# Altium project ICSL PS REV 0_2.PrjPcb
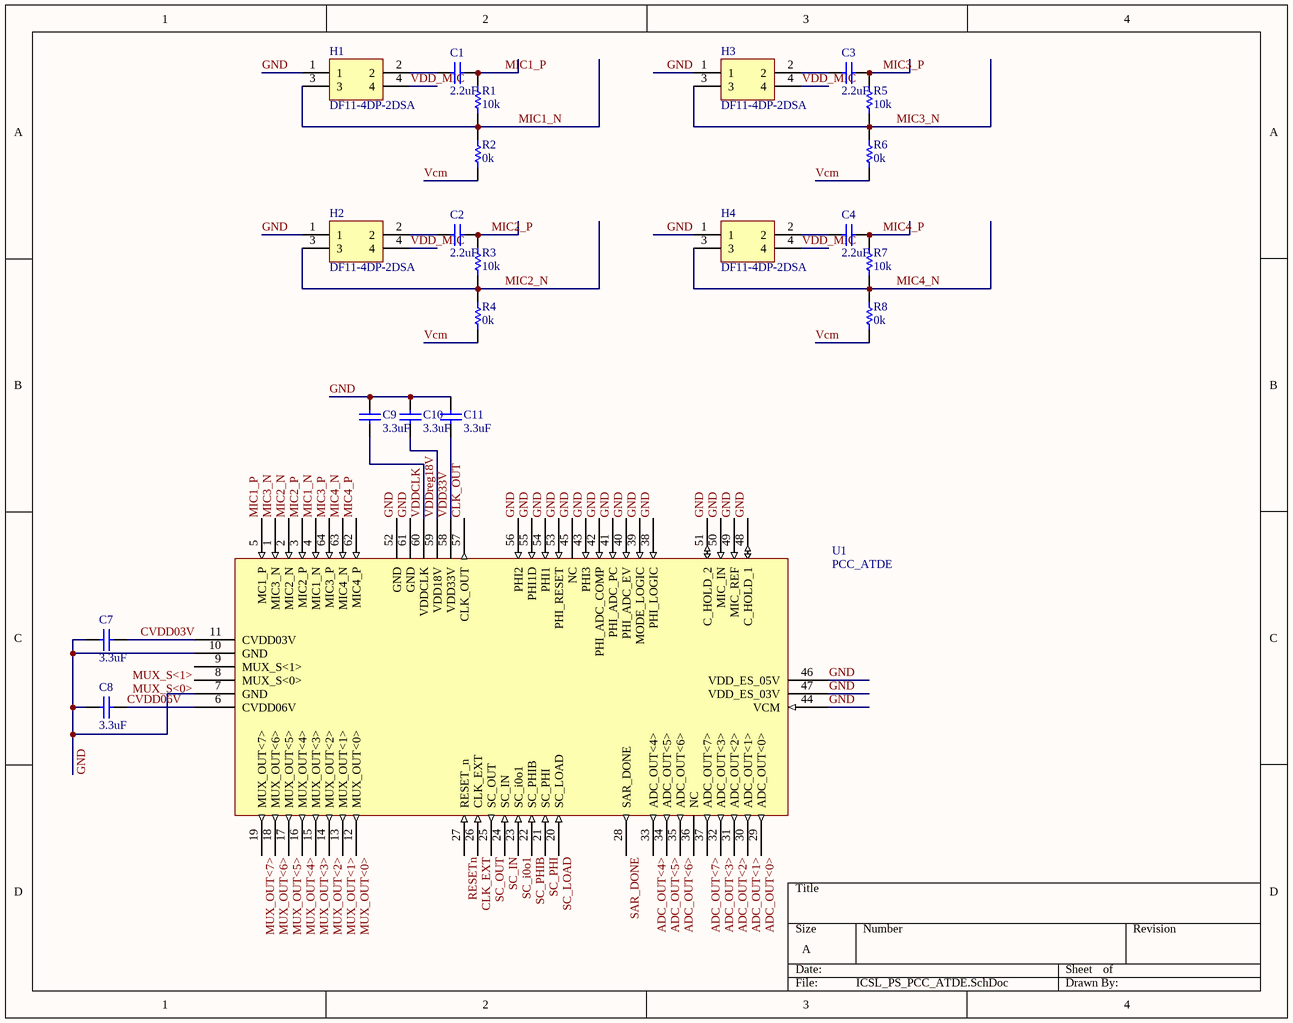
[diagram p0: ICSL_PS_PCC_ATDE.SchDoc]
5 sheets, 84 parts. Net scope: global (net labels, ports and power ports of the same name join across sheets).
Sheets:
  ICSL_PS_PCC_ATDE.SchDoc
  ICSL_PS_POWER.SchDoc
  ICSL_PS_BMD.SchDoc
  ICSL_PS_CON.SchDoc
  ICSL_PS_MEMS_MIC_V1.SchDoc

## Sheet ICSL_PS_PCC_ATDE.SchDoc
size A

### Parts
C1  2.2uF  [CAPC1608X90X35NL15T15]
C2  2.2uF  [CAPC1608X90X35NL15T15]
C3  2.2uF  [CAPC1608X90X35NL15T15]
C4  2.2uF  [CAPC1608X90X35NL15T15]
C7  3.3uF  [CAPC1608X90X35NL15T15]
C8  3.3uF  [CAPC1608X90X35NL15T15]
C9  3.3uF  [CAPC1608X90X35NL15T15]
C10  3.3uF  [CAPC1608X90X35NL15T15]
C11  3.3uF  [CAPC1608X90X35NL15T15]
H1  DF11-4DP-2DSA  [PCB-xg1cw1zwm1fua28k7qwq-1]
H2  DF11-4DP-2DSA  [PCB-xg1cw1zwm1fua28k7qwq-1]
H3  DF11-4DP-2DSA  [PCB-xg1cw1zwm1fua28k7qwq-1]
H4  DF11-4DP-2DSA  [PCB-xg1cw1zwm1fua28k7qwq-1]
R1  10k  [RESC1609X50X30NL10T20]
R2  0k  [RESC1609X50X30NL10T20]
R3  10k  [RESC1609X50X30NL10T20]
R4  0k  [RESC1609X50X30NL10T20]
R5  10k  [RESC1609X50X30NL10T20]
R6  0k  [RESC1609X50X30NL10T20]
R7  10k  [RESC1609X50X30NL10T20]
R8  0k  [RESC1609X50X30NL10T20]
U1  PCC_ATDE  [Quad64]

### Nets
ADC_OUT<0>: U1.29(ADC_OUT<0>)
ADC_OUT<1>: U1.30(ADC_OUT<1>)
ADC_OUT<2>: U1.31(ADC_OUT<2>)
ADC_OUT<3>: U1.32(ADC_OUT<3>)
ADC_OUT<4>: U1.33(ADC_OUT<4>)
ADC_OUT<5>: U1.34(ADC_OUT<5>)
ADC_OUT<6>: U1.35(ADC_OUT<6>)
ADC_OUT<7>: U1.37(ADC_OUT<7>)
CLK_EXT: U1.26(CLK_EXT)
CLK_OUT: U1.57(CLK_OUT)
CVDD03V: C7.1 U1.11(CVDD03V)
CVDD06V: C8.1 U1.6(CVDD06V)
GND: C7.2 C8.2 C9.2 C10.1 C11.1 H1.1 H2.1 H3.1 H4.1 U1.7(GND) U1.10(GND) U1.38(PHI_LOGIC) U1.39(MODE_LOGIC) U1.40(PHI_ADC_EV) U1.41(PHI_ADC_PC) U1.42(PHI_ADC_COMP) U1.43(PHI3) U1.44(VCM) U1.45(NC) U1.46(VDD_ES_05V) U1.47(VDD_ES_03V) U1.48(C_HOLD_1) U1.49(MIC_REF) U1.50(MIC_IN) U1.51(C_HOLD_2) U1.52(GND) U1.53(PHI_RESET) U1.54(PHI1) U1.55(PHI1D) U1.56(PHI2) U1.61(GND)
MIC1_N: H1.3 R1.2 R2.2 U1.4(MIC1_N)
MIC1_P: C1.2 R1.1 U1.5(MC1_P)
MIC2_N: H2.3 R3.2 R4.2 U1.2(MIC2_N)
MIC2_P: C2.2 R3.1 U1.3(MIC2_P)
MIC3_N: H3.3 R5.2 R6.2 U1.1(MIC3_N)
MIC3_P: C3.2 R5.1 U1.64(MIC3_P)
MIC4_N: H4.3 R7.2 R8.2 U1.63(MIC4_N)
MIC4_P: C4.2 R7.1 U1.62(MIC4_P)
MUX_OUT<0>: U1.12(MUX_OUT<0>)
MUX_OUT<1>: U1.13(MUX_OUT<1>)
MUX_OUT<2>: U1.14(MUX_OUT<2>)
MUX_OUT<3>: U1.15(MUX_OUT<3>)
MUX_OUT<4>: U1.16(MUX_OUT<4>)
MUX_OUT<5>: U1.17(MUX_OUT<5>)
MUX_OUT<6>: U1.18(MUX_OUT<6>)
MUX_OUT<7>: U1.19(MUX_OUT<7>)
MUX_S<0>: U1.8(MUX_S<0>)
MUX_S<1>: U1.9(MUX_S<1>)
RESETn: U1.27(RESET_n)
SAR_DONE: U1.28(SAR_DONE)
SC_i0o1: U1.23(SC_i0o1)
SC_IN: U1.24(SC_IN)
SC_LOAD: U1.20(SC_LOAD)
SC_OUT: U1.25(SC_OUT)
SC_PHI: U1.21(SC_PHI)
SC_PHIB: U1.22(SC_PHIB)
Vcm: R2.1 R4.1 R6.1 R8.1
VDD33V: C11.2 U1.58(VDD33V)
VDD_MIC: H1.4 H2.4 H3.4 H4.4
VDDCLK: C9.1 U1.60(VDDCLK)
VDDreg18V: C10.2 U1.59(VDD18V)
NetC1_1: C1.1 H1.2
NetC2_1: C2.1 H2.2
NetC3_1: C3.1 H3.2
NetC4_1: C4.1 H4.2

Not connected (* = marked no-connect by the designer): U1 36(NC)

### Library data of the parts
C1-C4 C7-C11 = CMP-4105021-1: Multilayer Ceramic Capacitors MLCC - SMD/SMT 0603 10uF 4VOLTS X5R 10%; Manufacturer Part Number: 06034D106KAT2A; Temperature Coefficient / Code: +/- 15 %; Case Width: 0.81 mm; Voltage Rating DC: 4 V; Brand: AVX; Case Length: 1.6 mm; Type: Commercial Surface Mount Chip; Case Height: 0.9 mm; Dimensions: 0.81 mm W x 1.6 mm L x 0.9 mm H; Capacitance: 10 uF; Termination Style: SMD/SMT; Dielectric: X5R; RoHS: Details; Factory Pack Quantity: 3000; Ciiva URL: https://ciiva.com/part/06034d106kat2a-4105021; Operating Temperature Range: - 55 C to + 85 C; Case Code - mm: 1608; Case Code - in: 0603; Tolerance: 10 %; Voltage Rating: 4 V; Manufacturer: AVX; Minimum Operating Temperature: - 55 C; Product Category: Multilayer Ceramic Capacitors MLCC - SMD/SMT; Maximum Operating Temperature: + 85 C; Package / Case: 0603 (1608 metric); Product: General Type MLCCs; Packaging: Reel; CiivaID: 4105021
H1-H4 = DF11-4DP-2DSA(01): 4 Position 2mm Pitch Dual Row (2x2) Straight Through Hole Pin Header; Housing Color: Black; Contact Material: Brass
R1 R3 = CMP-1856112-2: RES SMD OHM 5% 1/10W 0603; Lead-Free Status: Lead Free; Power Rating: 0.1 W; Resistance: 200K; Temperature Coefficient: 200.0 ppm/°C; Voltage Rating (DC): 75.0 V; Case/Package: 0603; Mounting Style: Surface Mount; Number of Pins: 2; Octopart Url: https://octopart.com/crcw06032m20jnea-vishay-46591516; OctopartID: 4b2a80e6805094ed; Packaging: Cut Tape (CT); Resistance Tolerance: ±5%; RoHS: Compliant; Size-Height: 0.00045 m; Size-Length: 0.00155 m; Size-Width: 0.00085 m
R2 R4 R8 = CMP-1856112-2: RES SMD 2.2M OHM 5% 1/10W 0603; Lead-Free Status: Lead Free; Power Rating: 0.1 W; Resistance: 0; Temperature Coefficient: 200.0 ppm/°C; Voltage Rating (DC): 75.0 V; Case/Package: 0603; Mounting Style: Surface Mount; Number of Pins: 2; Octopart Url: https://octopart.com/crcw06032m20jnea-vishay-46591516; OctopartID: 4b2a80e6805094ed; Packaging: Cut Tape (CT); Resistance Tolerance: ±5%; RoHS: Compliant; Size-Height: 0.00045 m; Size-Length: 0.00155 m; Size-Width: 0.00085 m
R5 = CMP-1856112-2: RES SMD 2.2M OHM 5% 1/10W 0603; Lead-Free Status: Lead Free; Power Rating: 0.1 W; Resistance: 200K; Temperature Coefficient: 200.0 ppm/°C; Voltage Rating (DC): 75.0 V; Case/Package: 0603; Mounting Style: Surface Mount; Number of Pins: 2; Octopart Url: https://octopart.com/crcw06032m20jnea-vishay-46591516; OctopartID: 4b2a80e6805094ed; Packaging: Cut Tape (CT); Resistance Tolerance: ±5%; RoHS: Compliant; Size-Height: 0.00045 m; Size-Length: 0.00155 m; Size-Width: 0.00085 m
R6 = CMP-1856112-2: RES SMD 2.2M OHM 5% 1/10W 0603; Lead-Free Status: Lead Free; Power Rating: 0.1 W; Resistance: 2200000.0 Ω; Temperature Coefficient: 200.0 ppm/°C; Voltage Rating (DC): 75.0 V; Case/Package: 0603; Mounting Style: Surface Mount; Number of Pins: 2; Octopart Url: https://octopart.com/crcw06032m20jnea-vishay-46591516; OctopartID: 4b2a80e6805094ed; Packaging: Cut Tape (CT); Resistance Tolerance: ±5%; RoHS: Compliant; Size-Height: 0.00045 m; Size-Length: 0.00155 m; Size-Width: 0.00085 m
R7 = CMP-1856112-2: RES SMD  OHM 5% 1/10W 0603; Lead-Free Status: Lead Free; Power Rating: 0.1 W; Resistance: 2200000.0 Ω; Resistance Tolerance: 200K; Temperature Coefficient: 200.0 ppm/°C; Voltage Rating (DC): 75.0 V; Case/Package: 0603; Mounting Style: Surface Mount; Number of Pins: 2; Octopart Url: https://octopart.com/crcw06032m20jnea-vishay-46591516; OctopartID: 4b2a80e6805094ed; Packaging: Cut Tape (CT); RoHS: Compliant; Size-Height: 0.00045 m; Size-Length: 0.00155 m; Size-Width: 0.00085 m
U1 = CMP-47mcin27x3h8n761pmad-3: ASP; CustomComponentID: 47mcin27x3h8n761pmad

## Sheet ICSL_PS_POWER.SchDoc
size 381 x 241 mm
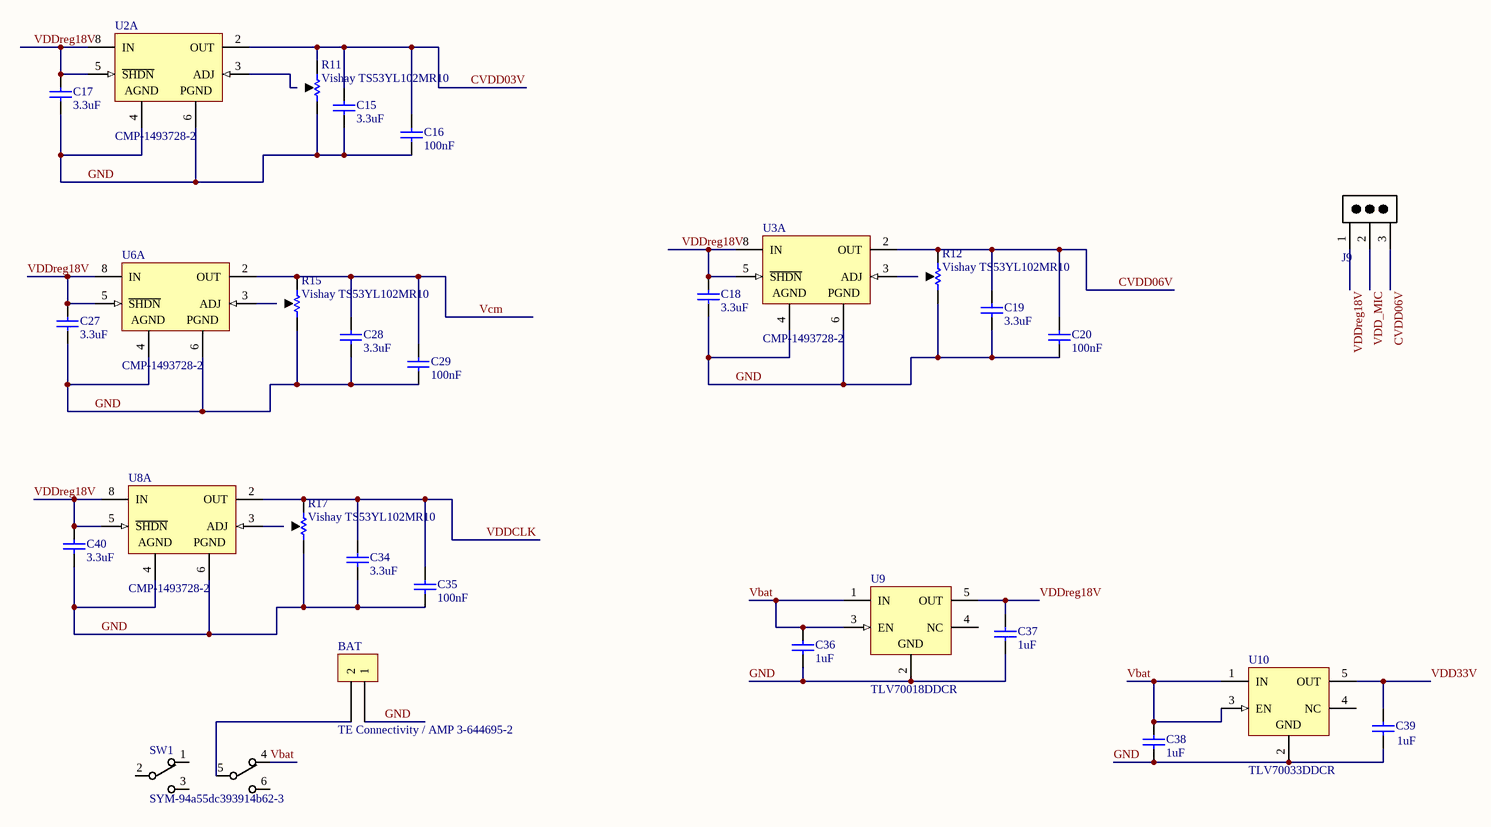
[diagram p1: ICSL_PS_POWER.SchDoc]

### Parts
BAT  TE Connectivity / AMP 3-644695-2  [PCB-i8m17woc8q0u0fbeoczf-1]
C15  3.3uF
C16  100nF  [CAPC1608X90X35NL15T15]
C17  3.3uF
C18  3.3uF
C19  3.3uF  [CAPC2013X94X50LL20T25]
C20  100nF  [CAPC1608X90X35NL15T15]
C27  3.3uF  [CAPC2013X94X50LL20T25]
C28  3.3uF  [CAPC2013X94X50LL20T25]
C29  100nF  [CAPC1608X90X35NL15T15]
C34  3.3uF  [CAPC2013X94X50LL20T25]
C35  100nF  [CAPC1608X90X35NL15T15]
C36  1uF  [CAPC2013X94X50LL20T25]
C37  1uF  [CAPC2013X94X50LL20T25]
C38  1uF  [CAPC2013X94X50LL20T25]
C39  1uF  [CAPC2013X94X50LL20T25]
C40  3.3uF  [CAPC2013X94X50LL20T25]
J9  3M 961103-6404-AR  [JP2]  (value not drawn)
R11  Vishay TS53YL102MR10  [PCB-2411124-1]
R12  Vishay TS53YL102MR10  [PCB-2411124-1]
R15  Vishay TS53YL102MR10  [PCB-2411124-1]
R17  Vishay TS53YL102MR10  [PCB-2411124-1]
SW1  SYM-94a55dc393914b62-3  [PCB-ixy6r264hz8u4okoxsrw-1]
U2  CMP-1493728-2  [LT-S8-8_N]  (part A of 2)
U3  CMP-1493728-2  [LT-S8-8_N]  (part A of 2)
U6  CMP-1493728-2  [LT-S8-8_N]  (part A of 2)
U8  CMP-1493728-2  [LT-S8-8_N]  (part A of 2)
U9  TLV70018DDCR  [TI-DDC5_L]
U10  TLV70033DDCR  [PCB-o8wu4fpdtd8bqe2xojjk-1]

### Nets
CVDD03V: C15.2 C16.1 R11.1 U2.2(OUT)
CVDD06V: C19.2 C20.1 J9.3 R12.1 U3.2(OUT)
GND: BAT.1 C15.1 C16.2 C17.1 C18.1 C19.1 C20.2 C27.1 C28.1 C29.1 C34.1 C35.1 C36.1 C37.1 C38.1 C39.2 C40.1 R11.3 R12.3 R15.3 R17.3 U2.4(AGND) U2.6(PGND) U3.4(AGND) U3.6(PGND) U6.4(AGND) U6.6(PGND) U8.4(AGND) U8.6(PGND) U9.2(GND) U10.2(GND)
Vbat: C36.2 C38.2 SW1.4 U9.1(IN) U9.3(EN) U10.1(IN) U10.3(EN)
Vcm: C28.2 C29.2 R15.1 U6.2(OUT)
VDD33V: C39.1 U10.5(OUT)
VDD_MIC: J9.2
VDDCLK: C34.2 C35.2 R17.1 U8.2(OUT)
VDDreg18V: C17.2 C18.2 C27.2 C37.2 C40.2 J9.1 U2.5(~{SHDN}) U2.8(IN) U3.5(~{SHDN}) U3.8(IN) U6.5(~{SHDN}) U6.8(IN) U8.5(~{SHDN}) U8.8(IN) U9.5(OUT)
NetBAT_2: BAT.2 SW1.5
NetR11_2: R11.2 U2.3(ADJ)
NetR12_2: R12.2 U3.3(ADJ)
NetR15_2: R15.2 U6.3(ADJ)
NetR17_2: R17.2 U8.3(ADJ)

Not connected (* = marked no-connect by the designer): SW1 1 2 3 6; U9 4(NC); U10 4(NC)

### Library data of the parts
BAT = CMP-2792ecc2f21af855-6: Connector Unshrouded Header 2 Position 2.54mm Solder Straight Thru-Hole; Voltage Rating (AC): 250 V; Number of Positions: 2; Mounting Angle: 180 °; Lead-Free Status: Lead Free; Shrouded: No; ELV Compliant: Compliant; Gender: Male; Flammability Rating: UL 94 V-0; Number of Rows: 1; Housing Color: Natural; Size-Width: 2.34 mm; Mounting Style: Through Hole; Orientation: Vertical; Lifecycle Status: Active; Manufacturer Part Number: 3-644695-2; OctopartID: 2792ecc2f21af855; RoHS: Compliant; Pin Pitch: 2.54 mm; Contact Plating: Tin; Housing Material: Polyester; Size-Length: 4.80 mm; Contact Material: Copper Alloy; Size-Height: 2.54 mm; Number of Contacts: 2; Packaging: Box, Bag; Octopart URL: http://octopart.com/3-644695-2-te+connectivity+%2F+amp-39514350
C15 C17 C18 = CMP-126016-2: CAP CER 1500PF 50V 10% X7R 0805; Manufacturer Part Number: 08055C152KAT2A; Capacitance: 1.5e-09 F; Case/Package (SI): 2012; Lead-Free Status: Lead Free; Voltage Rating (DC): 50.0 V; Capacitance Tolerance: ±10%; Case/Package: 0805; Dielectric Characteristic: X7R; Mounting Style: Surface Mount; Number of Pins: 2; Octopart Url: https://octopart.com/08055c152kat2a-avx+interconnect+%2F+elco-40100580; OctopartID: c94f02260ecd1688; Packaging: Cut Tape (CT); REACH SVHC Compliance: No SVHC; RoHS: Compliant; Size-Height: 0.00071 m; Size-Length: 0.00201 m; Size-Width: 0.00125 m
C16 C20 C29 C35 = CMP-4105021-1: Multilayer Ceramic Capacitors MLCC - SMD/SMT 0603 10uF 4VOLTS X5R 10%; Manufacturer Part Number: 06034D106KAT2A; Capacitance: .1 uF; Temperature Coefficient / Code: +/- 15 %; Case Width: 0.81 mm; Voltage Rating DC: 4 V; Brand: AVX; Case Length: 1.6 mm; Type: Commercial Surface Mount Chip; Case Height: 0.9 mm; Dimensions: 0.81 mm W x 1.6 mm L x 0.9 mm H; Termination Style: SMD/SMT; Dielectric: X5R; RoHS: Details; Factory Pack Quantity: 3000; Ciiva URL: https://ciiva.com/part/06034d106kat2a-4105021; Operating Temperature Range: - 55 C to + 85 C; Case Code - mm: 1608; Case Code - in: 0603; Tolerance: 10 %; Voltage Rating: 4 V; Manufacturer: AVX; Minimum Operating Temperature: - 55 C; Product Category: Multilayer Ceramic Capacitors MLCC - SMD/SMT; Maximum Operating Temperature: + 85 C; Package / Case: 0603 (1608 metric); Product: General Type MLCCs; Packaging: Reel; CiivaID: 4105021
C19 C27 C28 C34 C36-C40 = CMP-126016-2: CAP CER 1500PF 50V 10% X7R 0805; Capacitance: 1.5e-09 F; Case/Package (SI): 2012; Lead-Free Status: Lead Free; Voltage Rating (DC): 50.0 V; Capacitance Tolerance: ±10%; Case/Package: 0805; Dielectric Characteristic: X7R; Mounting Style: Surface Mount; Number of Pins: 2; Octopart Url: https://octopart.com/08055c152kat2a-avx+interconnect+%2F+elco-40100580; OctopartID: c94f02260ecd1688; Packaging: Cut Tape (CT); REACH SVHC Compliance: No SVHC; RoHS: Compliant; Size-Height: 0.00071 m; Size-Length: 0.00201 m; Size-Width: 0.00125 m
J9 = 961103-6404-AR: CONN HEADER VERT SGL 3POS GOLD; Number of Contacts: 3; Gender: Male; Mounting Style: Through Hole; Contact Plating: Gold; Octopart Url: https://octopart.com/961103-6404-ar-3m-14400730; OctopartID: 3fbff66ea603e078; Contact Material: Copper Alloy; RoHS: Compliant
R11 = TS53YL102MR10: TRIMMER 1K OHM 0.25W SMD
R12 R15 R17 = CMP-2411124-3: TRIMMER 1K OHM 0.25W SMD
SW1 = JS202011SCQN: Slide Switch DPDT Surface Mount; Manufacturer: C&K; Vendor Part Number: 401-2002-1-ND; HelpURL: http://www.ckswitches.com/media/1422/js.pdf; Operating Temperature: -40°C ~ 85°C
U2 U3 U6 U8 = CMP-1493728-2: Low 160 mV Dropout Voltage, Internal PNP Pass Element, 200 mV Reference Voltage, 0.9 to 10 V Vin, Adjustable Vout, 8-pin SOIC (S8-8), -40 to 125 degC, Pb-Free; Dropout Voltage: 0.155 V; Lead-Free Status: Lead Free; Number of Outputs: 1; Output Current: 0.5 A; Mounting Style: Surface Mount; Number of Pins: 8; Octopart Url: https://octopart.com/lt3021es8%23pbf-linear+technology-2716766; OctopartID: 77c5bee626fda802; REACH SVHC Compliance: No SVHC; RoHS: Compliant
U9 = TLV70018DDCR: Single Output LDO, 200 mA, Fixed 1.8 V Output, 2 to 5.5 V Input, with Low IQ, 5-pin SOT (DDC), -40 to 125 degC, Green (RoHS & no Sb/Br); Dropout Voltage: 0.175 V; Lead-Free Status: Lead Free; Number of Regulated Outputs: 1; Output Capacitor Type: Ceramic; Output Current: 0.2 A; Quiescent Current: 3e-05 A; Lifecycle Status: Active; Number of Pins: 5; Octopart Url: https://octopart.com/tlv70018ddcr-texas+instruments-12195704; OctopartID: 0919c0a93b07d6de; REACH SVHC Compliance: No SVHC; RoHS: Compliant
U10 = TLV70033DDCR: Single Output LDO, 200 mA, Fixed 3.3 V Output, 2 to 5.5 V Input, with Low IQ, 5-pin SOT (DDC), -40 to 125 degC, Green (RoHS & no Sb/Br); Number of Regulated Outputs: 1; Dropout Voltage: 0.175 V; Output Current: 0.2 A; Quiescent Current: 3e-05 A; Output Capacitor Type: Ceramic; Lead-Free Status: Lead Free; OctopartID: 68e6a1564b0cb721; Packaging: Tape & Reel (TR); Number of Pins: 5; Octopart Url: https://octopart.com/tlv70033ddcr-texas+instruments-12191372; Lifecycle Status: Active; RoHS: Compliant

## Sheet ICSL_PS_BMD.SchDoc
size A
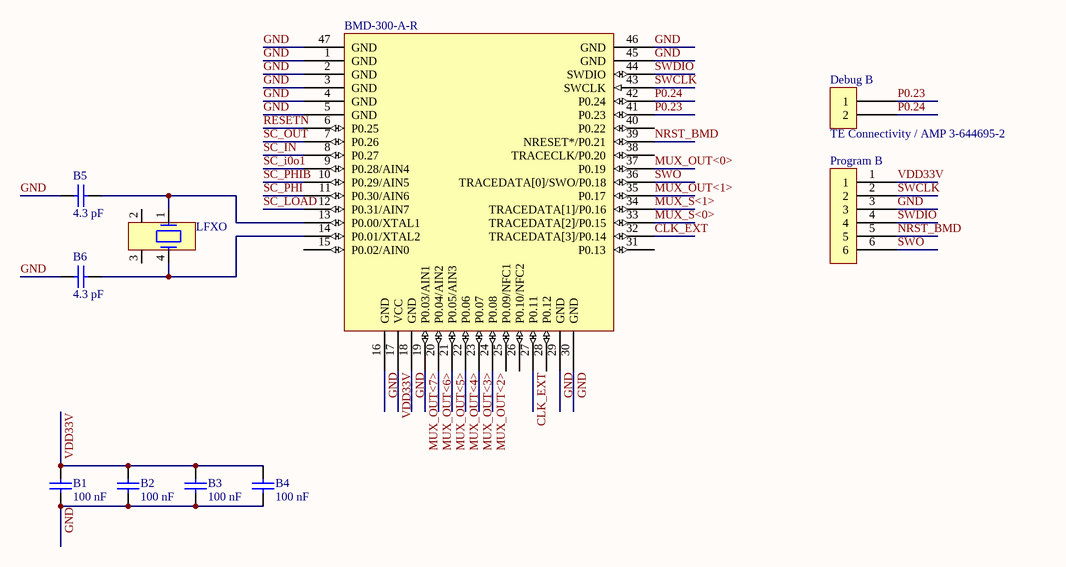
[diagram p2: ICSL_PS_BMD.SchDoc]

### Parts
B1  100 nF  [CAPC1608X90X35NL15T15]
B2  100 nF  [CAPC1608X90X35NL15T15]
B3  100 nF  [CAPC1608X90X35NL15T15]
B4  100 nF  [CAPC1608X90X35NL15T15]
B5  4.3 pF  [CAPC1608X90X35NL15T15]
B6  4.3 pF  [CAPC1608X90X35NL15T15]
BMD-300-A-R  Rigado BMD-300-A-R  [BMD-300 easy]  (value not drawn)
Debug_B  TE Connectivity / AMP 3-644695-2  [PCB-i8m17woc8q0u0fbeoczf-1]
LFXO  Abracon ABS25-32.768KHZ-6-T  [XTAL_4SM_8X3R8]  (value not drawn)
Program_B  TE Connectivity / AMP 5-146281-6  [PCB-ceua2d6kgzjhmbkiz2sm-1]  (value not drawn)

### Nets
CLK_EXT: BMD-300-A-R.27(P0.11) BMD-300-A-R.32(TRACEDATA[3]/P0.14)
GND: B1.1 B2.1 B3.1 B4.1 B5.1 B6.1 BMD-300-A-R.1(GND) BMD-300-A-R.2(GND) BMD-300-A-R.3(GND) BMD-300-A-R.4(GND) BMD-300-A-R.5(GND) BMD-300-A-R.16(GND) BMD-300-A-R.18(GND) BMD-300-A-R.29(GND) BMD-300-A-R.30(GND) BMD-300-A-R.45(GND) BMD-300-A-R.46(GND) BMD-300-A-R.47(GND) Program_B.3
MUX_OUT<0>: BMD-300-A-R.37(P0.19)
MUX_OUT<1>: BMD-300-A-R.35(P0.17)
MUX_OUT<2>: BMD-300-A-R.24(P0.08)
MUX_OUT<3>: BMD-300-A-R.23(P0.07)
MUX_OUT<4>: BMD-300-A-R.22(P0.06)
MUX_OUT<5>: BMD-300-A-R.21(P0.05/AIN3)
MUX_OUT<6>: BMD-300-A-R.20(P0.04/AIN2)
MUX_OUT<7>: BMD-300-A-R.19(P0.03/AIN1)
MUX_S<0>: BMD-300-A-R.33(TRACEDATA[2]/P0.15)
MUX_S<1>: BMD-300-A-R.34(TRACEDATA[1]/P0.16)
NRST_BMD: BMD-300-A-R.39(NRESET*/P0.21) Program_B.5
P0.23: BMD-300-A-R.41(P0.23) Debug_B.1
P0.24: BMD-300-A-R.42(P0.24) Debug_B.2
RESETn: BMD-300-A-R.6(P0.25)
SC_i0o1: BMD-300-A-R.9(P0.28/AIN4)
SC_IN: BMD-300-A-R.8(P0.27)
SC_LOAD: BMD-300-A-R.12(P0.31/AIN7)
SC_OUT: BMD-300-A-R.7(P0.26)
SC_PHI: BMD-300-A-R.11(P0.30/AIN6)
SC_PHIB: BMD-300-A-R.10(P0.29/AIN5)
SWCLK: BMD-300-A-R.43(SWCLK) Program_B.2
SWDIO: BMD-300-A-R.44(SWDIO) Program_B.4
SWO: BMD-300-A-R.36(TRACEDATA[0]/SWO/P0.18) Program_B.6
VDD33V: B1.2 B2.2 B3.2 B4.2 BMD-300-A-R.17(VCC) Program_B.1
NetB5_2: B5.2 BMD-300-A-R.13(P0.00/XTAL1) LFXO.1
NetB6_2: B6.2 BMD-300-A-R.14(P0.01/XTAL2) LFXO.4

Not connected (* = marked no-connect by the designer): BMD-300-A-R 15(P0.02/AIN0) 25(P0.09/NFC1) 26(P0.10/NFC2) 28(P0.12) 31(P0.13) 38(TRACECLK/P0.20) 40(P0.22); LFXO 2 3

### Library data of the parts
B1-B4 B6 = 06035A391GAT2A: CAP CER 390PF 50V 2% NP0 0603; Capacitance: 3.9e-10 F; Dielectric Characteristic: C0G/NP0; Lead-Free Status: Lead Free; Voltage Rating (DC): 50.0 V; Capacitance Tolerance: ±2%; Case/Package: 0603; Octopart Url: https://octopart.com/06035a391gat2a-avx+interconnect+%2F+elco-7765157; OctopartID: 340afd766dc9ebcd; Packaging: Tape; RoHS: Compliant
B5 = CMP-175820-2: CAP CER 390PF 50V 2% NP0 0603; Capacitance: 3.9e-10 F; Dielectric Characteristic: C0G/NP0; Lead-Free Status: Lead Free; Voltage Rating (DC): 50.0 V; Capacitance Tolerance: ±2%; Case/Package: 0603; Octopart Url: https://octopart.com/06035a391gat2a-avx+interconnect+%2F+elco-7765157; OctopartID: 340afd766dc9ebcd; Packaging: Tape; RoHS: Compliant
BMD-300-A-R = BMD-300-A-R: Mod Ble 4.2 Nordic Nrf52832 Soc; OctopartID: f77f3a358f6828b8; Octopart URL: http://octopart.com/bmd-300-a-r-rigado-71327089; Manufacturer Part Number: BMD-300-A-R
Debug_B = CMP-2792ecc2f21af855-6: as BAT on sheet ICSL_PS_POWER; Flammability Rating: UL 94 V-0; Number of Rows: 1; Housing Color: Natural; Size-Width: 2.34 mm; Mounting Style: Through Hole; Orientation: Vertical; Lifecycle Status: Active; Manufacturer Part Number: 3-644695-2; OctopartID: 2792ecc2f21af855; RoHS: Compliant; Pin Pitch: 2.54 mm; Contact Plating: Tin; Housing Material: Polyester; Size-Length: 4.80 mm; Contact Material: Copper Alloy; Size-Height: 2.54 mm; Number of Contacts: 2; Packaging: Box, Bag; Octopart URL: http://octopart.com/3-644695-2-te+connectivity+%2F+amp-39514350
LFXO = CMP-779567-4: ABS25 Series 32.768 kHz ±20 ppm 6 pF -40 to +85 °C SMT Low Frequency Crystal; Frequency: 32.8 kHz; Equivalent Series Resistance (ESR): 50.0 kΩ; Lead-Free Status: Lead Free; Load Capacitance: 6.00 pF; REACH SVHC Compliance: No SVHC; Mounting Style: Surface Mount; Seller Landing  Url: https://octopart-clicks.com/click/track?country=US&ak=8157f166&sig=0e47fd3&sid=1106&ppid=9289409&vpid=78496461&ct=offers; OctopartID: a1e368643a447e24; Octopart Url: http://octopart.com/abs25-32.768khz-6-t-abracon-9289409; Manufacturer Part Number: ABS25-32.768KHZ-6-T; RoHS: Compliant; Number of Pins: 4; Packaging: Cut Tape (CT)
Program_B = 5-146281-2: Header; Breakaway; 0.100 in.; PC Board; Single; 6; 0.025 in.; 0.12 in.; 3 A; Gender: Male; Number of Contacts: 6; Lead-Free Status: Lead Free; ELV Compliant: Compliant; Lifecycle Status: Active; OctopartID: 4f28847cfb2a90ef; Manufacturer Part Number: 5-146281-2; Housing Color: Black; Flammability Rating: UL 94 V-0; Orientation: Vertical; Octopart URL: https://octopart.com/5-146281-6-te+connectivity+%2F+amp-40753677; Contact Plating: Tin, Tin over Nickel, Gold; Contact Material: Copper Alloy; RoHS: Compliant; Mounting Style: PCB

## Sheet ICSL_PS_CON.SchDoc
size A
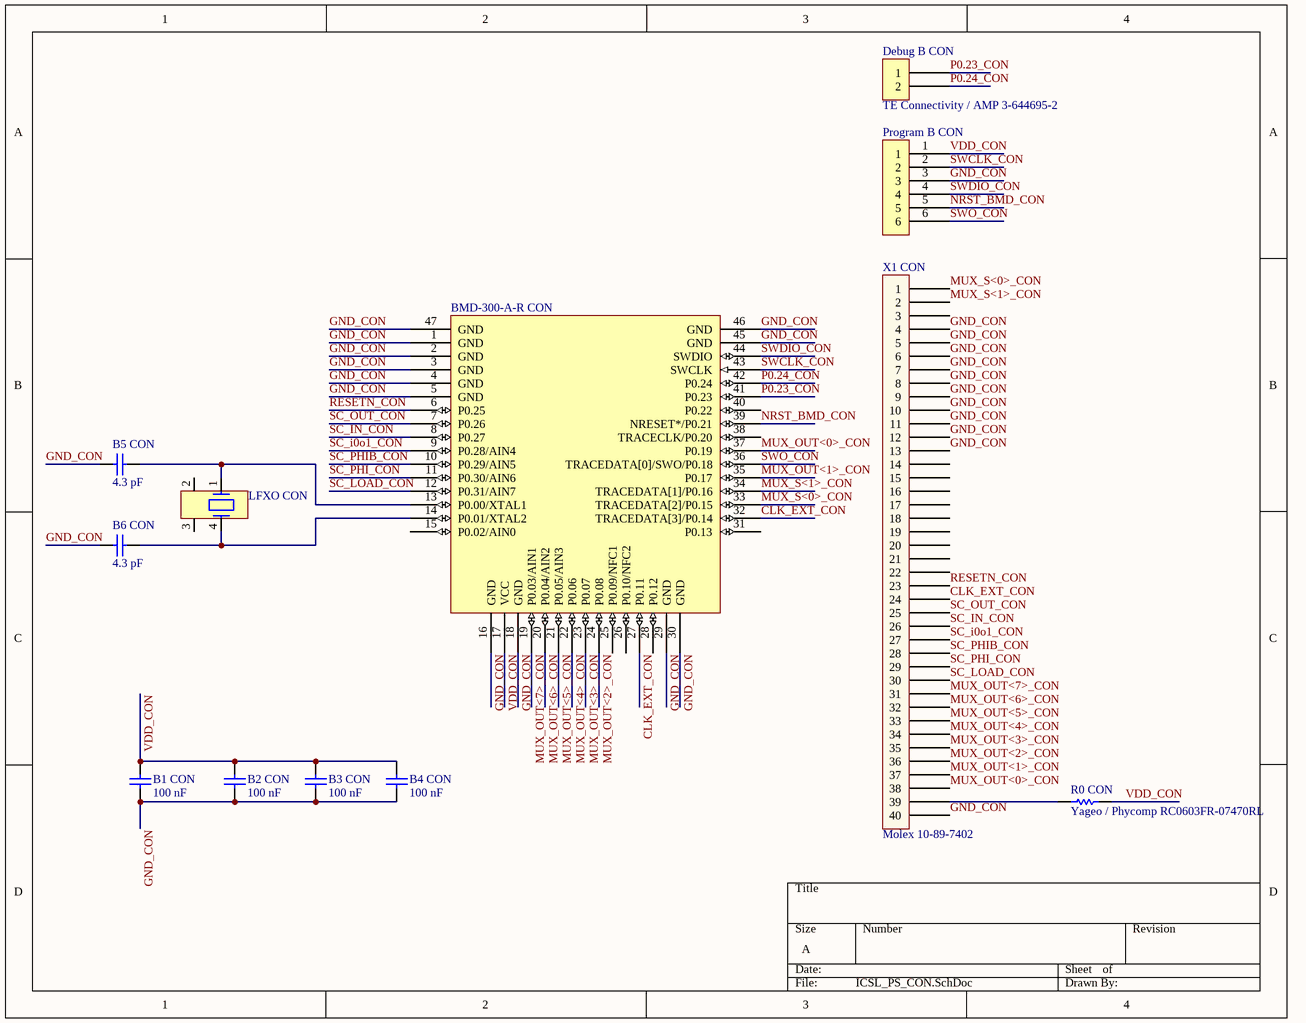
[diagram p3: ICSL_PS_CON.SchDoc]

### Parts
B1_CON  100 nF  [CAPC1608X90X35NL15T15]
B2_CON  100 nF  [CAPC1608X90X35NL15T15]
B3_CON  100 nF  [CAPC1608X90X35NL15T15]
B4_CON  100 nF  [CAPC1608X90X35NL15T15]
B5_CON  4.3 pF  [CAPC1608X90X35NL15T15]
B6_CON  4.3 pF  [CAPC1608X90X35NL15T15]
BMD-300-A-R_CON  Rigado BMD-300-A-R  [BMD-300 easy]  (value not drawn)
Debug_B_CON  TE Connectivity / AMP 3-644695-2  [PCB-i8m17woc8q0u0fbeoczf-1]
LFXO_CON  Abracon ABS25-32.768KHZ-6-T  [XTAL_4SM_8X3R8]  (value not drawn)
Program_B_CON  TE Connectivity / AMP 5-146281-6  [PCB-ceua2d6kgzjhmbkiz2sm-1]  (value not drawn)
R0_CON  Yageo / Phycomp RC0603FR-07470RL  [RESC1608X55X25LL10T15]
X1_CON  Molex 10-89-7402  [PCB-pj9c6d00mmo0g6kgjt7k-1]

### Nets
CLK_EXT_CON: BMD-300-A-R_CON.27(P0.11) BMD-300-A-R_CON.32(TRACEDATA[3]/P0.14) X1_CON.24
GND_CON: B1_CON.1 B2_CON.1 B3_CON.1 B4_CON.1 B5_CON.1 B6_CON.1 BMD-300-A-R_CON.1(GND) BMD-300-A-R_CON.2(GND) BMD-300-A-R_CON.3(GND) BMD-300-A-R_CON.4(GND) BMD-300-A-R_CON.5(GND) BMD-300-A-R_CON.16(GND) BMD-300-A-R_CON.18(GND) BMD-300-A-R_CON.29(GND) BMD-300-A-R_CON.30(GND) BMD-300-A-R_CON.45(GND) BMD-300-A-R_CON.46(GND) BMD-300-A-R_CON.47(GND) Program_B_CON.3 X1_CON.4 X1_CON.5 X1_CON.6 X1_CON.7 X1_CON.8 X1_CON.9 X1_CON.10 X1_CON.11 X1_CON.12 X1_CON.13 X1_CON.40
MUX_OUT<0>_CON: BMD-300-A-R_CON.37(P0.19) X1_CON.38
MUX_OUT<1>_CON: BMD-300-A-R_CON.35(P0.17) X1_CON.37
MUX_OUT<2>_CON: BMD-300-A-R_CON.24(P0.08) X1_CON.36
MUX_OUT<3>_CON: BMD-300-A-R_CON.23(P0.07) X1_CON.35
MUX_OUT<4>_CON: BMD-300-A-R_CON.22(P0.06) X1_CON.34
MUX_OUT<5>_CON: BMD-300-A-R_CON.21(P0.05/AIN3) X1_CON.33
MUX_OUT<6>_CON: BMD-300-A-R_CON.20(P0.04/AIN2) X1_CON.32
MUX_OUT<7>_CON: BMD-300-A-R_CON.19(P0.03/AIN1) X1_CON.31
MUX_S<0>_CON: BMD-300-A-R_CON.33(TRACEDATA[2]/P0.15) X1_CON.1
MUX_S<1>_CON: BMD-300-A-R_CON.34(TRACEDATA[1]/P0.16) X1_CON.2
NRST_BMD_CON: BMD-300-A-R_CON.39(NRESET*/P0.21) Program_B_CON.5
P0.23_CON: BMD-300-A-R_CON.41(P0.23) Debug_B_CON.1
P0.24_CON: BMD-300-A-R_CON.42(P0.24) Debug_B_CON.2
RESETN_CON: BMD-300-A-R_CON.6(P0.25) X1_CON.23
SC_i0o1_CON: BMD-300-A-R_CON.9(P0.28/AIN4) X1_CON.27
SC_IN_CON: BMD-300-A-R_CON.8(P0.27) X1_CON.26
SC_LOAD_CON: BMD-300-A-R_CON.12(P0.31/AIN7) X1_CON.30
SC_OUT_CON: BMD-300-A-R_CON.7(P0.26) X1_CON.25
SC_PHI_CON: BMD-300-A-R_CON.11(P0.30/AIN6) X1_CON.29
SC_PHIB_CON: BMD-300-A-R_CON.10(P0.29/AIN5) X1_CON.28
SWCLK_CON: BMD-300-A-R_CON.43(SWCLK) Program_B_CON.2
SWDIO_CON: BMD-300-A-R_CON.44(SWDIO) Program_B_CON.4
SWO_CON: BMD-300-A-R_CON.36(TRACEDATA[0]/SWO/P0.18) Program_B_CON.6
VDD_CON: B1_CON.2 B2_CON.2 B3_CON.2 B4_CON.2 BMD-300-A-R_CON.17(VCC) Program_B_CON.1 R0_CON.2
NetB5_CON_2: B5_CON.2 BMD-300-A-R_CON.13(P0.00/XTAL1) LFXO_CON.1
NetB6_CON_2: B6_CON.2 BMD-300-A-R_CON.14(P0.01/XTAL2) LFXO_CON.4
NetR0_CON_1: R0_CON.1 X1_CON.39

Not connected (* = marked no-connect by the designer): BMD-300-A-R_CON 15(P0.02/AIN0) 25(P0.09/NFC1) 26(P0.10/NFC2) 28(P0.12) 31(P0.13) 38(TRACECLK/P0.20) 40(P0.22); LFXO_CON 2 3; X1_CON 3 14 15 16 17 18 19 20 21 22

### Library data of the parts
B1_CON B2_CON B3_CON B4_CON = 06035A391GAT2A: as B1 on sheet ICSL_PS_BMD; Capacitance Tolerance: ±2%; Case/Package: 0603; Octopart Url: https://octopart.com/06035a391gat2a-avx+interconnect+%2F+elco-7765157; OctopartID: 340afd766dc9ebcd; Packaging: Tape; RoHS: Compliant
B5_CON B6_CON = CMP-175820-2: as B5 on sheet ICSL_PS_BMD; Capacitance Tolerance: ±2%; Case/Package: 0603; Octopart Url: https://octopart.com/06035a391gat2a-avx+interconnect+%2F+elco-7765157; OctopartID: 340afd766dc9ebcd; Packaging: Tape; RoHS: Compliant
BMD-300-A-R_CON = BMD-300-A-R: Mod Ble 4.2 Nordic Nrf52832 Soc; OctopartID: f77f3a358f6828b8; Octopart URL: http://octopart.com/bmd-300-a-r-rigado-71327089; Manufacturer Part Number: BMD-300-A-R
Debug_B_CON = CMP-2792ecc2f21af855-6: as BAT on sheet ICSL_PS_POWER; Flammability Rating: UL 94 V-0; Number of Rows: 1; Housing Color: Natural; Size-Width: 2.34 mm; Mounting Style: Through Hole; Orientation: Vertical; Lifecycle Status: Active; Manufacturer Part Number: 3-644695-2; OctopartID: 2792ecc2f21af855; RoHS: Compliant; Pin Pitch: 2.54 mm; Contact Plating: Tin; Housing Material: Polyester; Size-Length: 4.80 mm; Contact Material: Copper Alloy; Size-Height: 2.54 mm; Number of Contacts: 2; Packaging: Box, Bag; Octopart URL: http://octopart.com/3-644695-2-te+connectivity+%2F+amp-39514350
LFXO_CON = CMP-779567-4: as LFXO on sheet ICSL_PS_BMD; REACH SVHC Compliance: No SVHC; Mounting Style: Surface Mount; Seller Landing  Url: https://octopart-clicks.com/click/track?country=US&ak=8157f166&sig=0e47fd3&sid=1106&ppid=9289409&vpid=78496461&ct=offers; OctopartID: a1e368643a447e24; Octopart Url: http://octopart.com/abs25-32.768khz-6-t-abracon-9289409; Manufacturer Part Number: ABS25-32.768KHZ-6-T; RoHS: Compliant; Number of Pins: 4; Packaging: Cut Tape (CT)
Program_B_CON = 5-146281-2: as Program_B on sheet ICSL_PS_BMD; Lifecycle Status: Active; OctopartID: 4f28847cfb2a90ef; Manufacturer Part Number: 5-146281-2; Housing Color: Black; Flammability Rating: UL 94 V-0; Orientation: Vertical; Octopart URL: https://octopart.com/5-146281-6-te+connectivity+%2F+amp-40753677; Contact Plating: Tin, Tin over Nickel, Gold; Contact Material: Copper Alloy; RoHS: Compliant; Mounting Style: PCB
R0_CON = RC0603FR-07470RL: RES SMD 470 OHM 1% 1/10W 0603; Lead-Free Status: Lead Free; Power Rating: 0.1 W; Resistance: 470.0 Ω; Voltage Rating (DC): 50.0 V; Case/Package: 0603; Mounting Style: Surface Mount; Number of Pins: 2; Octopart Url: https://octopart.com/rc0603fr-07470rl-yageo-39823780; OctopartID: 0ba8c0fd876ad46f; REACH SVHC Compliance: No SVHC; Resistance Tolerance: ±1%; RoHS: Compliant; Size-Height: 0.00045 m; Size-Length: 0.0016 m; Size-Width: 0.0008 m
X1_CON = 10-89-7402: Conn Unshrouded Header HDR 40 POS 2.54mm Solder ST Thru-Hole Bag; Number of Circuits: 40; ELV Compliant: Compliant; Voltage Rating (DC): 250 V; Current Rating: 3.00 A; Gender: Male; Glow Wire Compliant: Non-Compliant; Lead-Free Status: Lead Free; Number of Positions: 40; Housing Material: Thermoplastic; RoHS: Compliant; Octopart URL: http://octopart.com/10-89-7402-molex-16617; Pin Pitch: 2.54 mm; Contact Material: Brass; Size-Width: 5.08 mm; Contact Plating: Gold; OctopartID: 87af4ea5e2205868; Orientation: Vertical; Number of Contacts: 40; Mounting Style: Through Hole, PCB, Vertical; Housing Color: Black; Flammability Rating: UL 94 V-0; Material: Copper Alloy; Packaging: Bag; Halogen Free Status: Low Halogen; Lifecycle Status: Active; Size-Height: 2.29 mm; Size-Length: 50.5 mm; Manufacturer Part Number: 10-89-7402; Number of Rows: 2

## Sheet ICSL_PS_MEMS_MIC_V1.SchDoc
size A
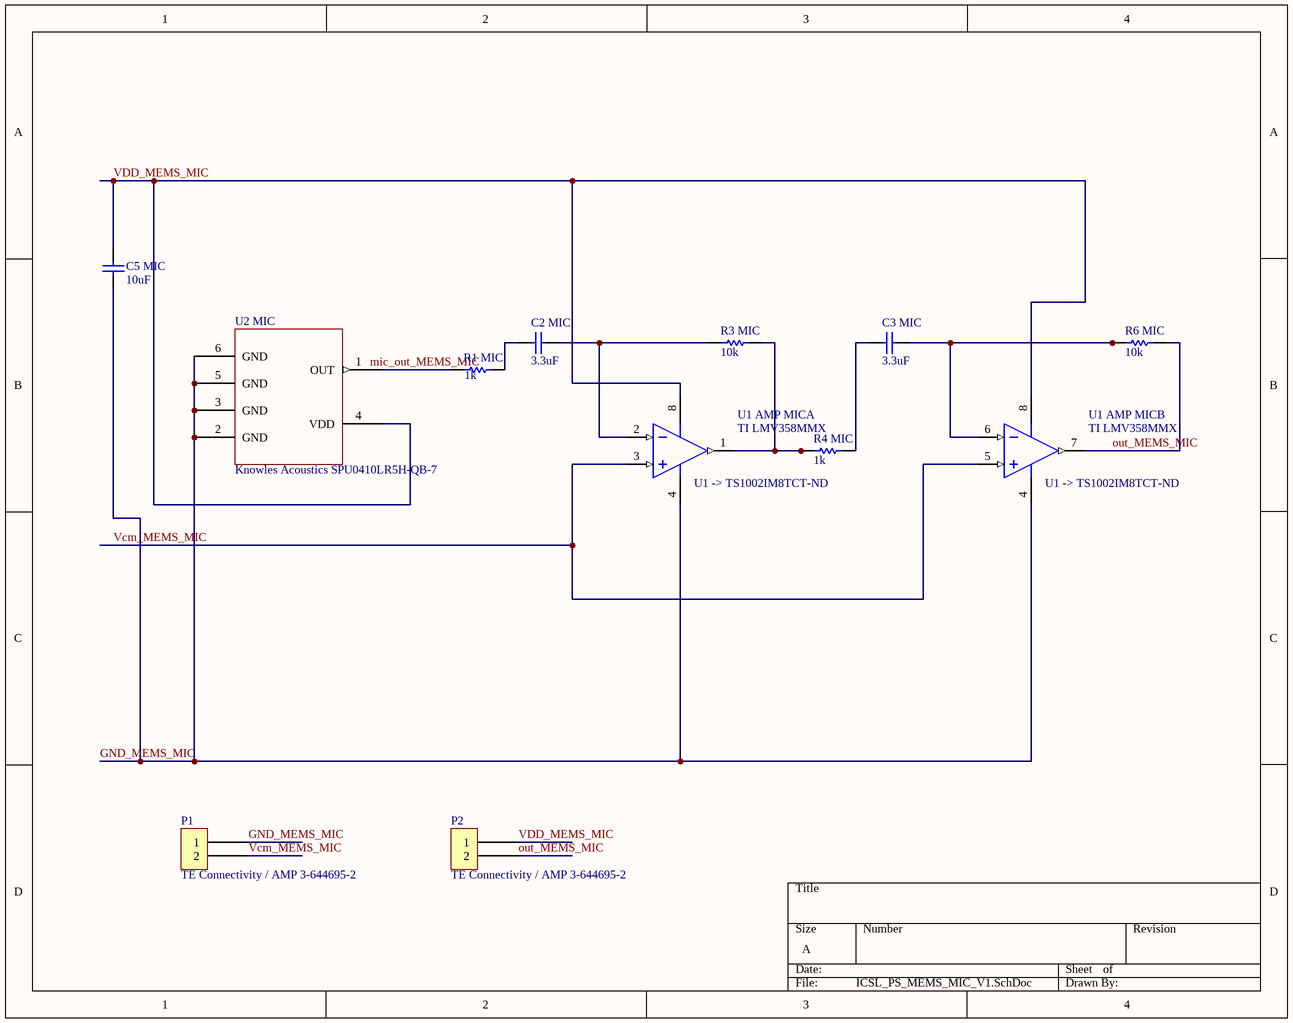
[diagram p4: ICSL_PS_MEMS_MIC_V1.SchDoc]

### Parts
C2_MIC  3.3uF  [CAPC1608X08M]
C3_MIC  3.3uF  [CAPC1608X08M]
C5_MIC  10uF  [CAPC2013X94X50LL20T25]
P1  TE Connectivity / AMP 3-644695-2  [PCB-i8m17woc8q0u0fbeoczf-1]
P2  TE Connectivity / AMP 3-644695-2  [PCB-i8m17woc8q0u0fbeoczf-1]
R1_MIC  1k  [RESC1608X06L]
R3_MIC  10k  [RESC1608X06L]
R4_MIC  1k  [RESC1608X06L]
R6_MIC  10k  [RESC1608X06L]
U1_AMP_MIC  TI LMV358MMX  [MSOP08]  (parts A,B of 2)
U2_MIC  Knowles Acoustics SPU0410LR5H-QB-7  [PCB-fhaaljglxn5h86y57i6s-1]

### Nets
GND_MEMS_MIC: C5_MIC.1 P1.1 U1_AMP_MIC.4(GND) U2_MIC.2(GND) U2_MIC.3(GND) U2_MIC.5(GND) U2_MIC.6(GND)
out_MEMS_MIC: P2.2 R6_MIC.2 U1_AMP_MIC.7(OUT2)
Vcm_MEMS_MIC: P1.2 U1_AMP_MIC.3(IN1+) U1_AMP_MIC.5(IN2+)
VDD_MEMS_MIC: C5_MIC.2 P2.1 U1_AMP_MIC.8(VCC+) U2_MIC.4(VDD)
NetC2_MIC_1: C2_MIC.1 R1_MIC.2
NetC2_MIC_2: C2_MIC.2 R3_MIC.1 U1_AMP_MIC.2(IN1-)
NetC3_MIC_1: C3_MIC.1 R4_MIC.2
NetC3_MIC_2: C3_MIC.2 R6_MIC.1 U1_AMP_MIC.6(IN2-)
NetR1_MIC_1: R1_MIC.1 U2_MIC.1(OUT)
NetR3_MIC_2: R3_MIC.2 R4_MIC.1 U1_AMP_MIC.1(OUT1)

### Notes on the sheet
- (near U1_AMP_MIC) U1 -> TS1002IM8TCT-ND
- Labels drawn without touching a wire or pin: mic_out_MEMS_MIC

### Library data of the parts
C2_MIC C3_MIC = CMP-nocyn7nhex2srcneo663-2: Generic 0603 Capacitor; Body Width: 0.8mm; CustomComponentID: nocyn7nhex2srcneo663
C5_MIC = CMP-126016-2: as C19 on sheet ICSL_PS_POWER; Capacitance Tolerance: ±10%; Case/Package: 0805; Dielectric Characteristic: X7R; Mounting Style: Surface Mount; Number of Pins: 2; Octopart Url: https://octopart.com/08055c152kat2a-avx+interconnect+%2F+elco-40100580; OctopartID: c94f02260ecd1688; Packaging: Cut Tape (CT); REACH SVHC Compliance: No SVHC; RoHS: Compliant; Size-Height: 0.00071 m; Size-Length: 0.00201 m; Size-Width: 0.00125 m
P1 P2 = CMP-2792ecc2f21af855-6: as BAT on sheet ICSL_PS_POWER; Flammability Rating: UL 94 V-0; Number of Rows: 1; Housing Color: Natural; Size-Width: 2.34 mm; Mounting Style: Through Hole; Orientation: Vertical; Lifecycle Status: Active; Manufacturer Part Number: 3-644695-2; OctopartID: 2792ecc2f21af855; RoHS: Compliant; Pin Pitch: 2.54 mm; Contact Plating: Tin; Housing Material: Polyester; Size-Length: 4.80 mm; Contact Material: Copper Alloy; Size-Height: 2.54 mm; Number of Contacts: 2; Packaging: Box, Bag; Octopart URL: http://octopart.com/3-644695-2-te+connectivity+%2F+amp-39514350
R1_MIC R4_MIC = CMP-iebvg68tg8mmdpxr2n2a-5: Generic 0603 Resistor; Body Width: 0.8mm; Tolerance: 1%; Body Height: 0.45mm; Resistance: 48.7K; Body Length: 1.6mm; Package (Imperial): 0603; Package (Metric): 1608; CustomComponentID: iebvg68tg8mmdpxr2n2a
R3_MIC R6_MIC = CMP-iebvg68tg8mmdpxr2n2a-5: Generic 0603 Resistor; Body Width: 0.8mm; Tolerance: 1%; Body Height: 0.45mm; Resistance: 1.18M; Body Length: 1.6mm; Package (Imperial): 0603; Package (Metric): 1608; CustomComponentID: iebvg68tg8mmdpxr2n2a
U1_AMP_MIC = CMP-4370069-2: IC OPAMP GP 1MHZ RRO 8VSSOP; Gain Bandwidth Product: 1000000.0 Hz; Input Offset Drift: 5e-06 V/K; Lead-Free Status: Contains Lead; Number of Channels: 2; Output Current: 0.06 A; Slew Rate: 1.0 V/μs; Case/Package: MSOP; Lifecycle Status: Active; Mounting Style: Surface Mount; Number of Circuits: 2; Number of Pins: 8; Octopart Url: https://octopart.com/lmv358mmx-texas+instruments-24850535; OctopartID: a6cd6ebcb3cc790a; Packaging: Reel; RoHS: Non-Compliant
U2_MIC = CMP-9a235714badd45e4-1: Mic Mems Analog Omni -38db; Directivity: Omnidirectional; Sensitivity: -38 dbV/Pa; Acoustic Overload Point: 118 dB SPL; DC Output: 0.73 V; Output Impedance: 400 ohm; Total Harmonic Distortion: 0.15 %; Input Current to Any Pin: +- 5 mA; OUT to Ground: -0.3, Vdd +0.3; Supply Voltage: 3.6 V; Signal to Noise Ratio: 63 db(A); Vdd to Ground: -0.5, +5.0 V; Supply Current: 120 microA; Polarity: Increasing output voltage; OctopartID: 9a235714badd45e4; Temperature Range: -40 to +100 C; Octopart URL: http://octopart.com/spu0410lr5h-qb-7-knowles+acoustics-71107992; Manufacturer Part Number: SPU0410LR5H-QB-7

## Nets that join several sheets
CLK_EXT: ICSL_PS_PCC_ATDE (U1.26), ICSL_PS_BMD (BMD-300-A-R.27 BMD-300-A-R.32)
CVDD03V: ICSL_PS_PCC_ATDE (C7.1 U1.11), ICSL_PS_POWER (C15.2 C16.1 R11.1 U2.2)
CVDD06V: ICSL_PS_PCC_ATDE (C8.1 U1.6), ICSL_PS_POWER (5 pins)
GND: ICSL_PS_PCC_ATDE (31 pins), ICSL_PS_POWER (31 pins), ICSL_PS_BMD (19 pins)
MUX_OUT<0>: ICSL_PS_PCC_ATDE (U1.12), ICSL_PS_BMD (BMD-300-A-R.37)
MUX_OUT<1>: ICSL_PS_PCC_ATDE (U1.13), ICSL_PS_BMD (BMD-300-A-R.35)
MUX_OUT<2>: ICSL_PS_PCC_ATDE (U1.14), ICSL_PS_BMD (BMD-300-A-R.24)
MUX_OUT<3>: ICSL_PS_PCC_ATDE (U1.15), ICSL_PS_BMD (BMD-300-A-R.23)
MUX_OUT<4>: ICSL_PS_PCC_ATDE (U1.16), ICSL_PS_BMD (BMD-300-A-R.22)
MUX_OUT<5>: ICSL_PS_PCC_ATDE (U1.17), ICSL_PS_BMD (BMD-300-A-R.21)
MUX_OUT<6>: ICSL_PS_PCC_ATDE (U1.18), ICSL_PS_BMD (BMD-300-A-R.20)
MUX_OUT<7>: ICSL_PS_PCC_ATDE (U1.19), ICSL_PS_BMD (BMD-300-A-R.19)
MUX_S<0>: ICSL_PS_PCC_ATDE (U1.8), ICSL_PS_BMD (BMD-300-A-R.33)
MUX_S<1>: ICSL_PS_PCC_ATDE (U1.9), ICSL_PS_BMD (BMD-300-A-R.34)
RESETn: ICSL_PS_PCC_ATDE (U1.27), ICSL_PS_BMD (BMD-300-A-R.6)
SC_i0o1: ICSL_PS_PCC_ATDE (U1.23), ICSL_PS_BMD (BMD-300-A-R.9)
SC_IN: ICSL_PS_PCC_ATDE (U1.24), ICSL_PS_BMD (BMD-300-A-R.8)
SC_LOAD: ICSL_PS_PCC_ATDE (U1.20), ICSL_PS_BMD (BMD-300-A-R.12)
SC_OUT: ICSL_PS_PCC_ATDE (U1.25), ICSL_PS_BMD (BMD-300-A-R.7)
SC_PHI: ICSL_PS_PCC_ATDE (U1.21), ICSL_PS_BMD (BMD-300-A-R.11)
SC_PHIB: ICSL_PS_PCC_ATDE (U1.22), ICSL_PS_BMD (BMD-300-A-R.10)
Vcm: ICSL_PS_PCC_ATDE (R2.1 R4.1 R6.1 R8.1), ICSL_PS_POWER (C28.2 C29.2 R15.1 U6.2)
VDD33V: ICSL_PS_PCC_ATDE (C11.2 U1.58), ICSL_PS_POWER (C39.1 U10.5), ICSL_PS_BMD (6 pins)
VDD_MIC: ICSL_PS_PCC_ATDE (H1.4 H2.4 H3.4 H4.4), ICSL_PS_POWER (J9.2)
VDDCLK: ICSL_PS_PCC_ATDE (C9.1 U1.60), ICSL_PS_POWER (C34.2 C35.2 R17.1 U8.2)
VDDreg18V: ICSL_PS_PCC_ATDE (C10.2 U1.59), ICSL_PS_POWER (15 pins)